# EAGLE schematic Vent_Base (EAGLE 6.5.0)
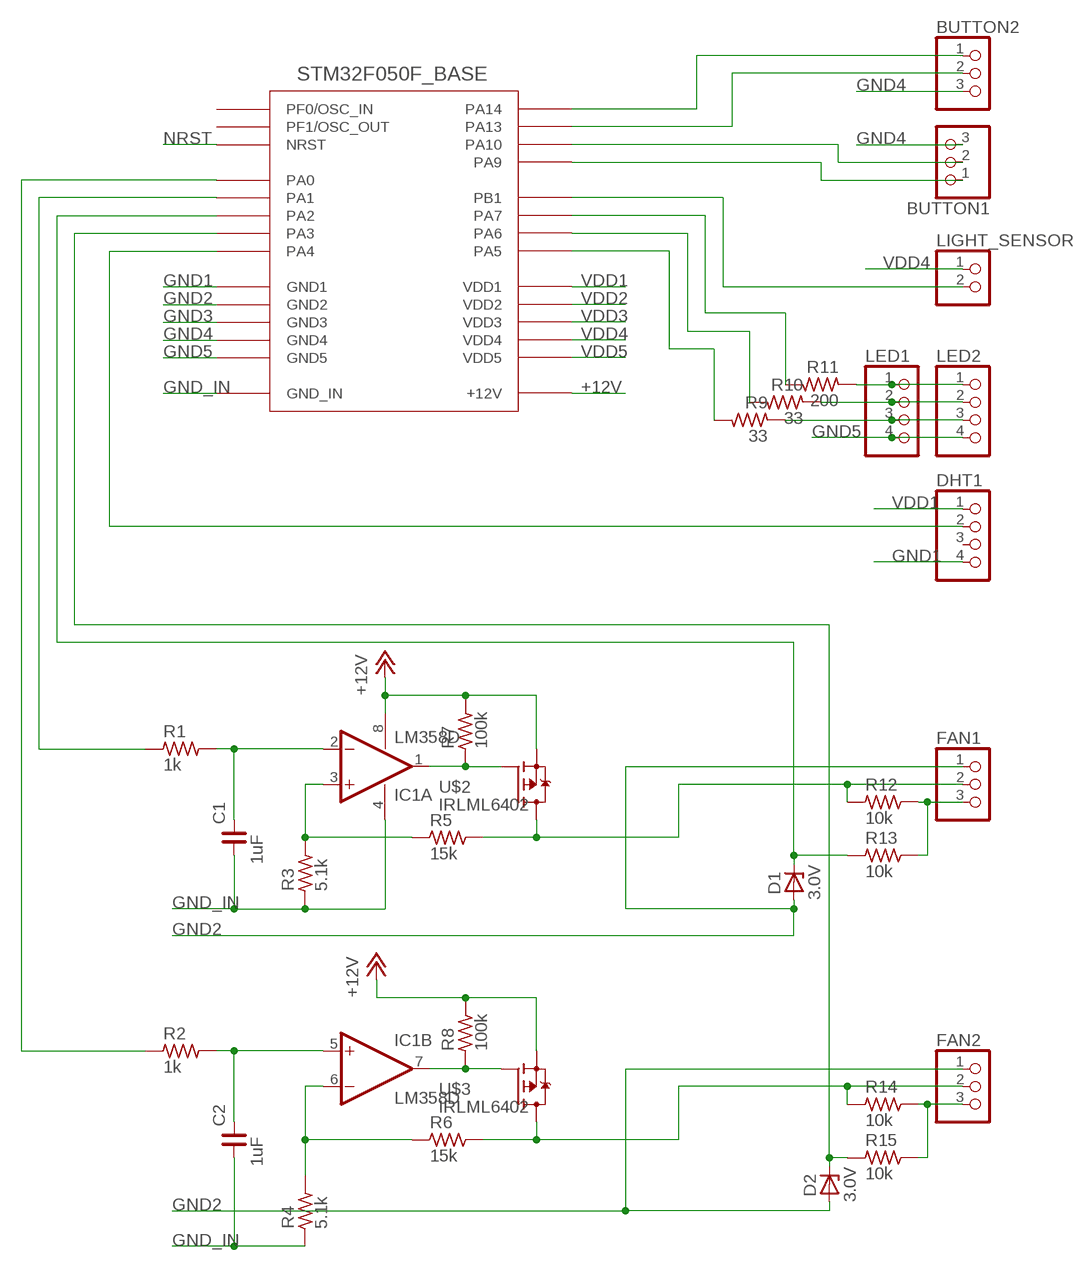
[diagram p0: schematic, sheet 1]

## Parts
BUTTON1  PINHD-1X03_2.54-S  [1X03-S]
BUTTON2  PINHD-1X03_2.54-S  [1X03-S]
C1  1uF  C_0805  [C0805]
C2  1uF  C_0805  [C0805]
D1  ZENER-DIODESOT23  [SOT23]
D2  ZENER-DIODESOT23  [SOT23]
DHT1  PINHD-1X04_2.54-S  [1X04-S]
FAN1  PINHD-1X03_2.54-S  [1X03-S]
FAN2  PINHD-1X03_2.54-S  [1X03-S]
IC1  LM358D  [SO08]
LED1  PINHD-1X04_2.54-S  [1X04-S]
LED2  PINHD-1X04_2.54-S  [1X04-S]
LIGHT_SENSOR  PINHD-1X02_2.54-S  [1X02-S]
R1  1k  R_1206  [R1206]
R2  1k  R_1206  [R1206]
R3  5.1k  R_1206  [R1206]
R4  5.1k  R_1206  [R1206]
R5  15k  R_1206  [R1206]
R6  15k  R_1206  [R1206]
R7  100k  R_1206  [R1206]
R8  100k  R_1206  [R1206]
R9  33  R_0805  [R0805]
R10  33  R_0805  [R0805]
R11  200  R_0805  [R0805]
R12  10k  R_1206  [R1206]
R13  10k  R_1206  [R1206]
R14  10k  R_1206  [R1206]
R15  10k  R_1206  [R1206]
U$1  STM32F050F_BASE_MOD  [STM32_BASE_MOD]
U$2  IRLML6402  [SOT23]
U$3  IRLML6402  [SOT23]

## Nets
+12V: IC1.8(P:V+) R7.2 R8.2 U$1.+12V U$2.2(S) U$3.2(S)
GND1: DHT1.4 U$1.GND1
GND2: D1.1(A) D2.1(A) FAN1.1 FAN2.1 U$1.GND2
GND3: U$1.GND3
GND4: BUTTON1.3 BUTTON2.3 U$1.GND4
GND5: LED1.4 LED2.4 U$1.GND5
GND_IN: C1.1 C2.1 IC1.4(P:V-) R3.1 R4.1 U$1.GND_IN
N$1: FAN2.3 R14.2 R15.2
N$2: FAN1.3 R12.2 R13.2
N$3: C1.2 IC1.2(A:-IN) R1.2
N$4: C2.2 IC1.5(B:+IN) R2.2
N$6: IC1.7(B:OUT) R8.1 U$3.1(G)
N$7: LED1.1 LED2.1 R11.1
N$11: IC1.3(A:+IN) R3.2 R5.1
N$12: LED1.2 LED2.2 R10.1
N$13: LED1.3 LED2.3 R9.1
N$19: IC1.1(A:OUT) R7.1 U$2.1(G)
N$20: FAN1.2 R5.2 R12.1 U$2.3(D)
N$21: FAN2.2 R6.2 R14.1 U$3.3(D)
N$22: IC1.6(B:-IN) R4.2 R6.1
NRST: U$1.NRST
PA0: R2.1 U$1.PA0
PA1: R1.1 U$1.PA1
PA2: D1.3(C) R13.1 U$1.PA2
PA3: D2.3(C) R15.1 U$1.PA3
PA4: DHT1.2 U$1.PA4
PA5: R9.2 U$1.PA5
PA6: R10.2 U$1.PA6
PA7: R11.2 U$1.PA7
PA9: BUTTON1.1 U$1.PA9
PA10: BUTTON1.2 U$1.PA10
PA13: BUTTON2.2 U$1.PA13
PA14: BUTTON2.1 U$1.PA14
PB1: LIGHT_SENSOR.2 U$1.PB1
VDD1: DHT1.1 U$1.VDD1
VDD2: U$1.VDD2
VDD3: U$1.VDD3
VDD4: LIGHT_SENSOR.1 U$1.VDD4
VDD5: U$1.VDD5
Unconnected: DHT1.3 U$1.PF0(PF0/OSC_IN) U$1.PF1(PF1/OSC_OUT)

## Library data of the parts
BUTTON1 BUTTON2 FAN1 FAN2 = pinhead-2:PINHD-1X03: PIN HEADER
C1 C2 = rc-master-smd:C_: NON-POLARIZED CAP
D1 D2 = diode:ZENER-DIODE: Z-Diode; BZX84C3V0: 3.0V
DHT1 LED1 LED2 = pinhead-2:PINHD-1X04: PIN HEADER
IC1 = linear:LM358: OP AMP also LM158; LM258; LM2904 Source: http://cache.national.com/ds/LM/LM158.pdf
LIGHT_SENSOR = pinhead-2:PINHD-1X02: PIN HEADER
R1-R15 = rc-master-smd:R_: RESISTOR
U$1 = my-library:STM32F050F_BASE: STM32F0F_Base_Module
U$2 U$3 = my-library:IRLML6402